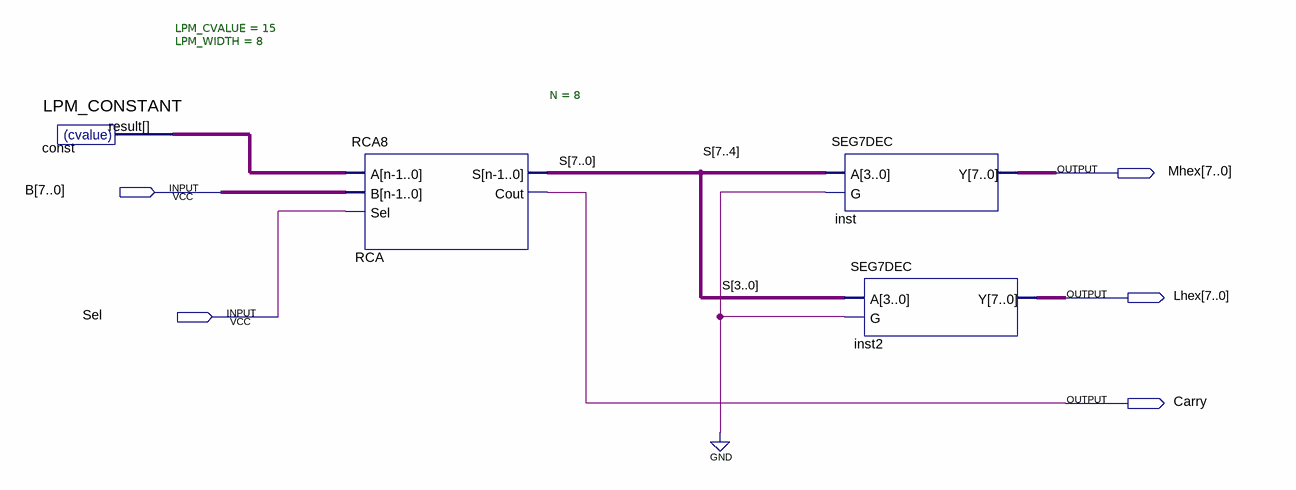
[diagram p0: schematic sheet]
// Quartus schematic RCA8seg7.bdf as structural Verilog: 4 symbols, 5 pins
module RCA8seg7 (
  input  [7:0] B,
  input  Sel,
  output [7:0] Mhex,
  output [7:0] Lhex,
  output Carry
);

  wire [7:0] const_result, S;

  LPM_CONSTANT #(.LPM_CVALUE(15), .LPM_WIDTH(8)) \const  (.result(const_result));
  RCA8 #(.N(8)) RCA (.A(const_result), .B(B), .Sel(Sel), .S(S), .Cout(Carry));
  SEG7DEC inst (.A(S[7:4]), .G(1'b0), .Y(Mhex));
  SEG7DEC inst2 (.A(S[3:0]), .G(1'b0), .Y(Lhex));
endmodule
